# Altium schematic sheet Display7SegAC.SCHDOC
size B
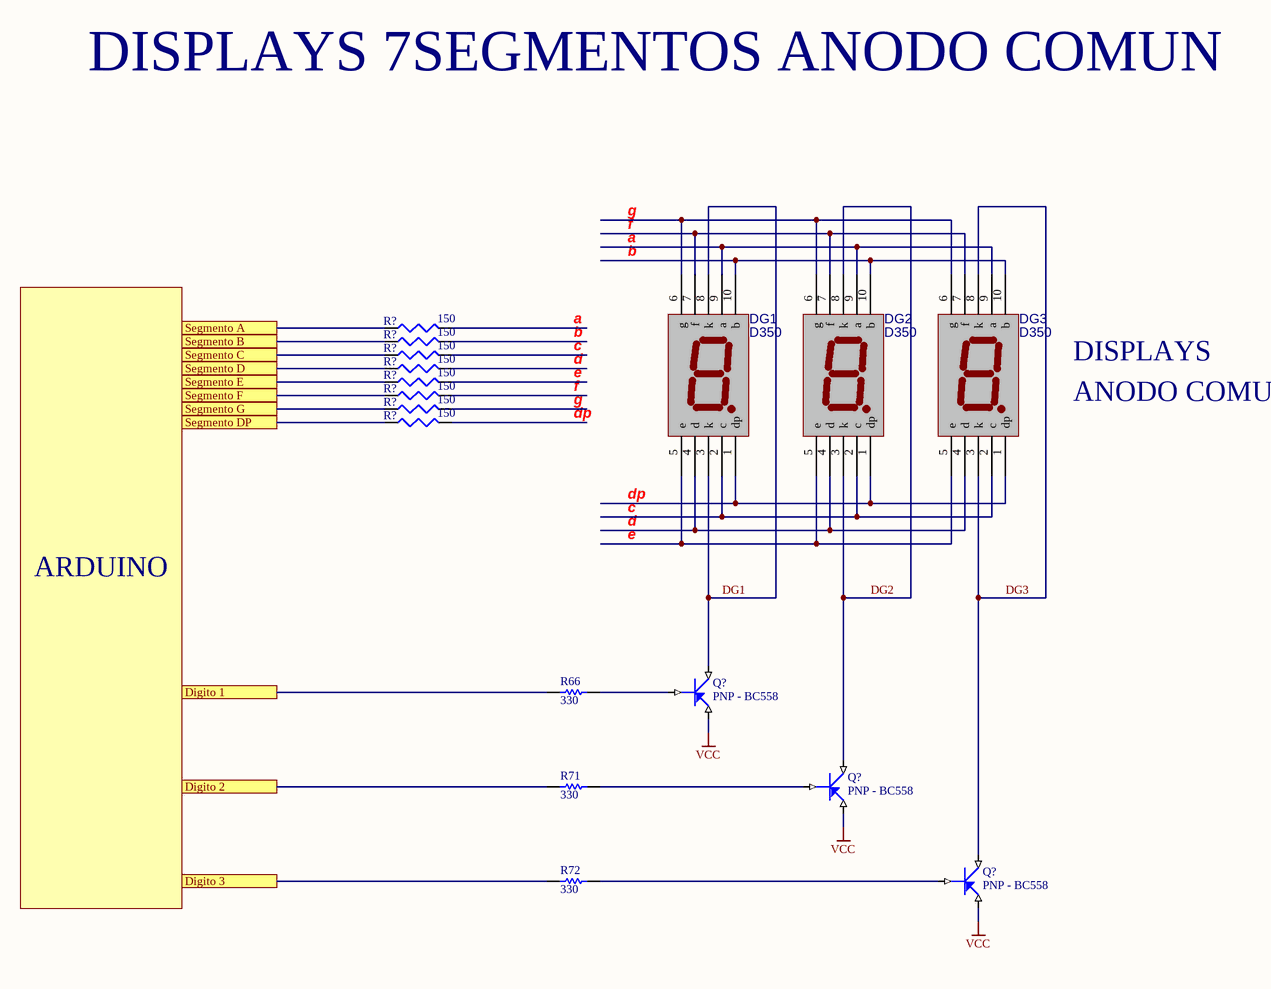
[diagram p0: Display7SegAC.SCHDOC]

## Parts
(Parts that share a designator on the sheet are numbered #1, #2 ... from top to bottom, then left to right.)
DG1  D350  [DISPLAY 7SEG 34x24]
DG2  D350  [DISPLAY 7SEG 34x24]
DG3  D350  [DISPLAY 7SEG 34x24]
Q?#1  PNP - BC558  [TO-92O]
Q?#2  PNP - BC558  [TO-92O]
Q?#3  PNP - BC558  [TO-92O]
R66  330  [0603]
R71  330  [0603]
R72  330  [0603]
R?#1  150  [AXIAL0.3]
R?#2  150  [AXIAL0.3]
R?#3  150  [AXIAL0.3]
R?#4  150  [AXIAL0.3]
R?#5  150  [AXIAL0.3]
R?#6  150  [AXIAL0.3]
R?#7  150  [AXIAL0.3]
R?#8  150  [AXIAL0.3]

## Ports
Digito 1, Digito 2, Digito 3, Segmento A, Segmento B, Segmento C, Segmento D, Segmento DP, Segmento E, Segmento F, Segmento G

## Nets
VCC: Q?#1.3 Q?#2.3 Q?#3.3
a: DG1.9(a) DG2.9(a) DG3.9(a) R?#1.2
b: DG1.10(b) DG2.10(b) DG3.10(b) R?#2.2
c: DG1.2(c) DG2.2(c) DG3.2(c) R?#3.2
d: DG1.4(d) DG2.4(d) DG3.4(d) R?#4.2
DG1: DG1.3(k) DG1.8(k) Q?#1.1
DG2: DG2.3(k) DG2.8(k) Q?#2.1
DG3: DG3.3(k) DG3.8(k) Q?#3.1
Digito 1: R66.1 ; port Digito 1
Digito 2: R71.1 ; port Digito 2
Digito 3: R72.1 ; port Digito 3
dp: DG1.1(dp) DG2.1(dp) DG3.1(dp) R?#8.2
e: DG1.5(e) DG2.5(e) DG3.5(e) R?#5.2
f: DG1.7(f) DG2.7(f) DG3.7(f) R?#6.2
g: DG1.6(g) DG2.6(g) DG3.6(g) R?#7.2
Segmento A: R?#1.1 ; port Segmento A
Segmento B: R?#2.1 ; port Segmento B
Segmento C: R?#3.1 ; port Segmento C
Segmento D: R?#4.1 ; port Segmento D
Segmento DP: R?#8.1 ; port Segmento DP
Segmento E: R?#5.1 ; port Segmento E
Segmento F: R?#6.1 ; port Segmento F
Segmento G: R?#7.1 ; port Segmento G
NetQ?#1_2: Q?#1.2 R66.2
NetQ?#2_2: Q?#2.2 R71.2
NetQ?#3_2: Q?#3.2 R72.2

## Notes on the sheet
- DISPLAYS 7SEGMENTOS ANODO COMUN
- DISPLAYS
- ANODO COMUN
- ARDUINO

## Library data of the parts
DG1-DG3 = DGT350: DIGITO DE 1/2 PULGADA; Text Field1: 0,4; 0.54: .54
Q?#1-Q?#3 = NPN: NPN Bipolar Transistor; Text Field1: 0,036
R66 R71 R72 = Res1: Resistencia; Manufacturer: Generic Components; Class I: Passive; Class II: Resistor; Published: 8-Jun-2000; Revision: July-2002: Re-released for DXP Platform.; Publisher: Altium Limited; Value: 330
R?#1-R?#8 = RES: Resistor; Text Field1: 0,012